# EasyEDA Pro project RCkid.epro, board Cartridge Connector
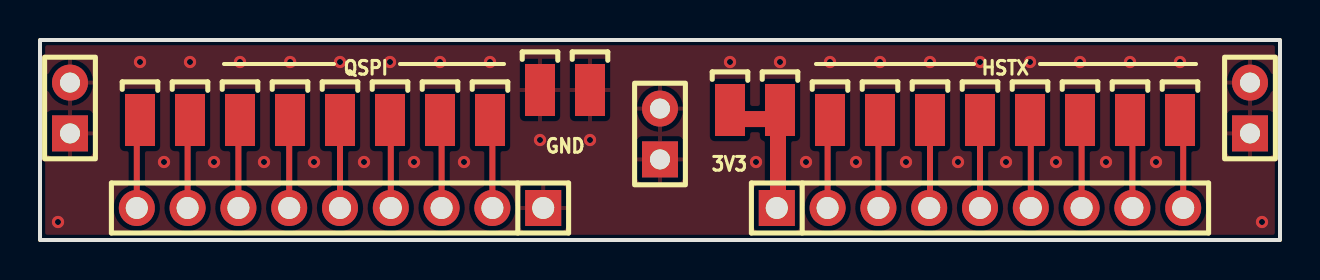
[diagram p28: board, top side]
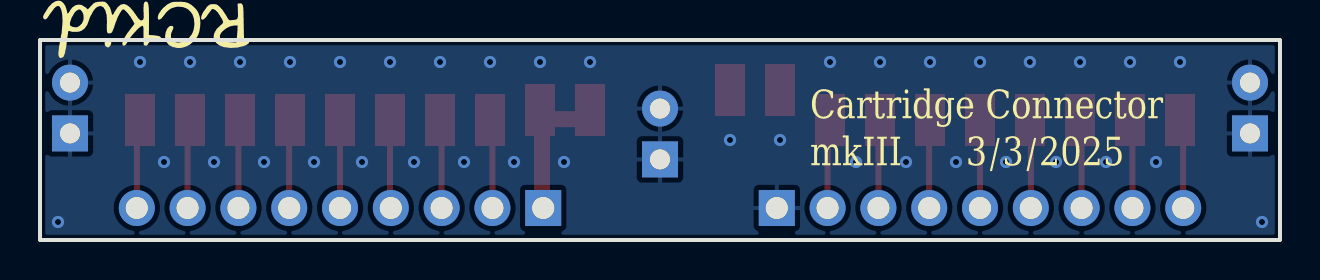
[diagram p29: board, bottom side, seen from below]

Outline 62 x 10 mm; copper layers: Top Layer, Bottom Layer. Coordinates in mm from the lower left corner of the outline.
Outline path: rectangle 0,10 62,0
Stack: Top Layer 0.035mm / Dielectric1 1.51mm FR4 er 4.5 / Bottom Layer 0.035mm

## Design rules (mm)
template: JLCPCB Capability(Two Layers Board)
spacing copperThickness1oz (default): track to track 0.102, other pairs 0.152 to 0.3
spacing copperThickness2oz: track to track 0.203, other pairs 0.152 to 0.3
track width copperThickness1oz (default): min 0.127, default 0.254, max 2.54
track width copperThickness2oz: min 0.203, default 0.254, max 2.54
differential pair differentialPair (default): width min 0.127, default 0.254, max 2.54; gap min 0.152, default 0.152
via viaSize (default): diameter min 0.5, default 0.61, max 10; hole min 0.3, default 0.305, max 6.3

## Placement (name value [footprint] x y rotation side)
3V3  BW0040BG-L3.0W1.5H1.5  [SMD_L3.0-W1.5_681-MB106E-2-P2]  34.5 6.5 270 top
GND  BW0040BG-L3.0W1.5H1.5  [SMD_L3.0-W1.5_681-MB106E-2-P2]  25 7.5 270 top
H1  -  [HDR-TH_9P-P2.54-V-M]  15 1.6 180 top
H2  -  [HDR-TH_9P-P2.54-V-M]  47 1.6 0 top
H3  -  [HDR-TH_2P-P2.54-V-M-1]  31 5.3 90 top
H4  -  [HDR-TH_2P-P2.54-V-M-1]  1.5 6.6 90 top
H5  -  [HDR-TH_2P-P2.54-V-M-1]  60.5 6.6 90 top
HSTX  BW0040BG-L3.0W1.5H1.5  [SMD_L3.0-W1.5_681-MB106E-2-P2]  39.5 6 270 top
QSPI  BW0040BG-L3.0W1.5H1.5  [SMD_L3.0-W1.5_681-MB106E-2-P2]  10 6 270 top
U4  BW0040BG-L3.0W1.5H1.5  [SMD_L3.0-W1.5_681-MB106E-2-P2]  5 6 270 top
U5  BW0040BG-L3.0W1.5H1.5  [SMD_L3.0-W1.5_681-MB106E-2-P2]  7.5 6 270 top
U7  BW0040BG-L3.0W1.5H1.5  [SMD_L3.0-W1.5_681-MB106E-2-P2]  12.5 6 270 top
U8  BW0040BG-L3.0W1.5H1.5  [SMD_L3.0-W1.5_681-MB106E-2-P2]  15 6 270 top
U9  BW0040BG-L3.0W1.5H1.5  [SMD_L3.0-W1.5_681-MB106E-2-P2]  17.5 6 270 top
U10  BW0040BG-L3.0W1.5H1.5  [SMD_L3.0-W1.5_681-MB106E-2-P2]  20 6 270 top
U11  BW0040BG-L3.0W1.5H1.5  [SMD_L3.0-W1.5_681-MB106E-2-P2]  22.5 6 270 top
U13  BW0040BG-L3.0W1.5H1.5  [SMD_L3.0-W1.5_681-MB106E-2-P2]  27.5 7.5 270 top
U15  BW0040BG-L3.0W1.5H1.5  [SMD_L3.0-W1.5_681-MB106E-2-P2]  37 6.5 270 top
U17  BW0040BG-L3.0W1.5H1.5  [SMD_L3.0-W1.5_681-MB106E-2-P2]  42 6 270 top
U18  BW0040BG-L3.0W1.5H1.5  [SMD_L3.0-W1.5_681-MB106E-2-P2]  44.5 6 270 top
U19  BW0040BG-L3.0W1.5H1.5  [SMD_L3.0-W1.5_681-MB106E-2-P2]  47 6 270 top
U20  BW0040BG-L3.0W1.5H1.5  [SMD_L3.0-W1.5_681-MB106E-2-P2]  49.5 6 270 top
U21  BW0040BG-L3.0W1.5H1.5  [SMD_L3.0-W1.5_681-MB106E-2-P2]  52 6 270 top
U22  BW0040BG-L3.0W1.5H1.5  [SMD_L3.0-W1.5_681-MB106E-2-P2]  54.5 6 270 top
U23  BW0040BG-L3.0W1.5H1.5  [SMD_L3.0-W1.5_681-MB106E-2-P2]  57 6 270 top

## Footprints (pads in the part's own frame, mm; a bottom-side part is the same pattern mirrored in y, then rotated)
HDR-TH_2P-P2.54-V-M-1
  rect 1.8x1.8 hole 1x0.9: 1(-1.27,0)
  round 1.8 hole 1x0.9: 2(1.27,0)
HDR-TH_9P-P2.54-V-M
  rect 1.8x1.8 hole 1.1x0.9: 1(-10.16,0)
  round 1.8 hole 1.1x0.9: 2(-7.62,0) 3(-5.08,0) 4(-2.54,0) 5(0,0) 6(2.54,0) 7(5.08,0) 8(7.62,0) 9(10.16,0)
SMD_L3.0-W1.5_681-MB106E-2-P2
  rect 2.6x1.5 smd: 1(0,0)

## Nets
As in the schematic.

## Via types
v1: diameter 0.61, hole 0.305, Top Layer to Bottom Layer, 38 vias

## Routing (per net, layer and track width the routed paths; a pad name or vN(x,y) marks a point on that pad's centre or on a via; arc(x,y) is an arc through that point)
GND:
  vias: v1(0.9,0.9) v1(5,8.9) v1(6.2,3.9) v1(7.5,8.9) v1(8.7,3.9) v1(10,8.9) v1(11.2,3.9) v1(12.51,8.9) v1(13.7,3.9) v1(15,8.9) v1(16.2,3.9) v1(17.5,8.9) v1(18.7,3.9) v1(20,8.9) v1(21.2,3.9) v1(22.5,8.9) v1(25,5) v1(27.5,5) v1(34.5,8.9) v1(35.8,3.9) v1(37,8.9) v1(38.3,3.9) v1(39.5,8.9) v1(40.8,3.9) v1(42,8.9) v1(43.3,3.9) v1(44.5,8.9) v1(45.9,3.9) v1(47,8.9) v1(48.3,3.9) v1(49.5,8.9) v1(50.8,3.9) v1(52,8.9) v1(53.3,3.9) v1(54.5,8.9) v1(55.8,3.9) v1(57,8.9) v1(61.1,0.9)
$1N2052: length 4.1
  Top Layer w0.3: 4.84,2 4.84,5.84 U4.1
$1N2058: length 4
  Top Layer w0.3: U5.1 7.38,5.88 7.38,2
$1N2065: length 4
  Top Layer w0.3: QSPI.1 9.92,5.92 9.92,2
$1N2075: length 4
  Top Layer w0.3: U7.1 12.46,5.96 12.46,2
$1N2082: length 4
  Top Layer w0.3: 15,2 U8.1
$1N2087: length 4
  Top Layer w0.3: U9.1 17.54,5.96 17.54,2
$1N2094: length 4
  Top Layer w0.3: 20.08,2 20.08,5.92 U10.1
$1N2101: length 4
  Top Layer w0.3: 22.62,2 22.62,5.88 U11.1
$1N2108: length 4.1
  Top Layer w0.3: 57.16,2 57.16,5.84 U23.1
$1N2118: length 4
  Top Layer w0.3: 54.62,2 54.62,5.88 U22.1
$1N2128: length 4
  Top Layer w0.3: U21.1 52.08,5.92 52.08,2
$1N2135: length 4
  Top Layer w0.3: 49.54,2 49.54,5.96 U20.1
$1N2142: length 4.1
  Top Layer w0.254: 46.89,6 46.94,6.05
  Top Layer w0.3: 47,2 U19.1
$1N2147: length 4.1
  Top Layer w0.254: 44.46,2 44.5,2.04 ; 44.35,5.96 44.44,6.05
  Top Layer w0.3: 44.5,2.04 U18.1
$1N2154: length 4
  Top Layer w0.3: 41.92,2 41.92,5.92 U17.1
$1N2161: length 4
  Top Layer w0.3: 39.38,2 39.38,5.88 HSTX.1
$1N2168: length 6.3
  Top Layer w0.8: 36.9,5.5 36.9,2.06 36.84,2 ; 34.44,6.05 36.94,6.05 36.73,5.84

## Copper pours and planes (outline as drawn; the poured copper is in the pictures)
GND on Top Layer: 0,10 62,10 62,0 0,0
GND on Bottom Layer: 0,10 62,10 62,0 0,0

## Text on the board
Bottom Silkscreen Layer: Cartridge Connector / mkIII      3/3/2025
Top Silkscreen Layer: JLCJLCJLCJLC
